# Altium schematic sheet INTERFACE.SchDoc
size A4
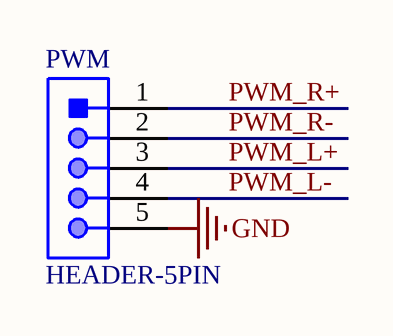
[diagram p0: INTERFACE.SchDoc]

## Parts
PWM  HEADER-5PIN  [HEADER_5P_1.25_up]

## Nets
GND: PWM.5
PWM_L+: PWM.3
PWM_L-: PWM.4
PWM_R+: PWM.1
PWM_R-: PWM.2